# EAGLE design 0121-dcdc1805030 (EAGLE 9.6.2)
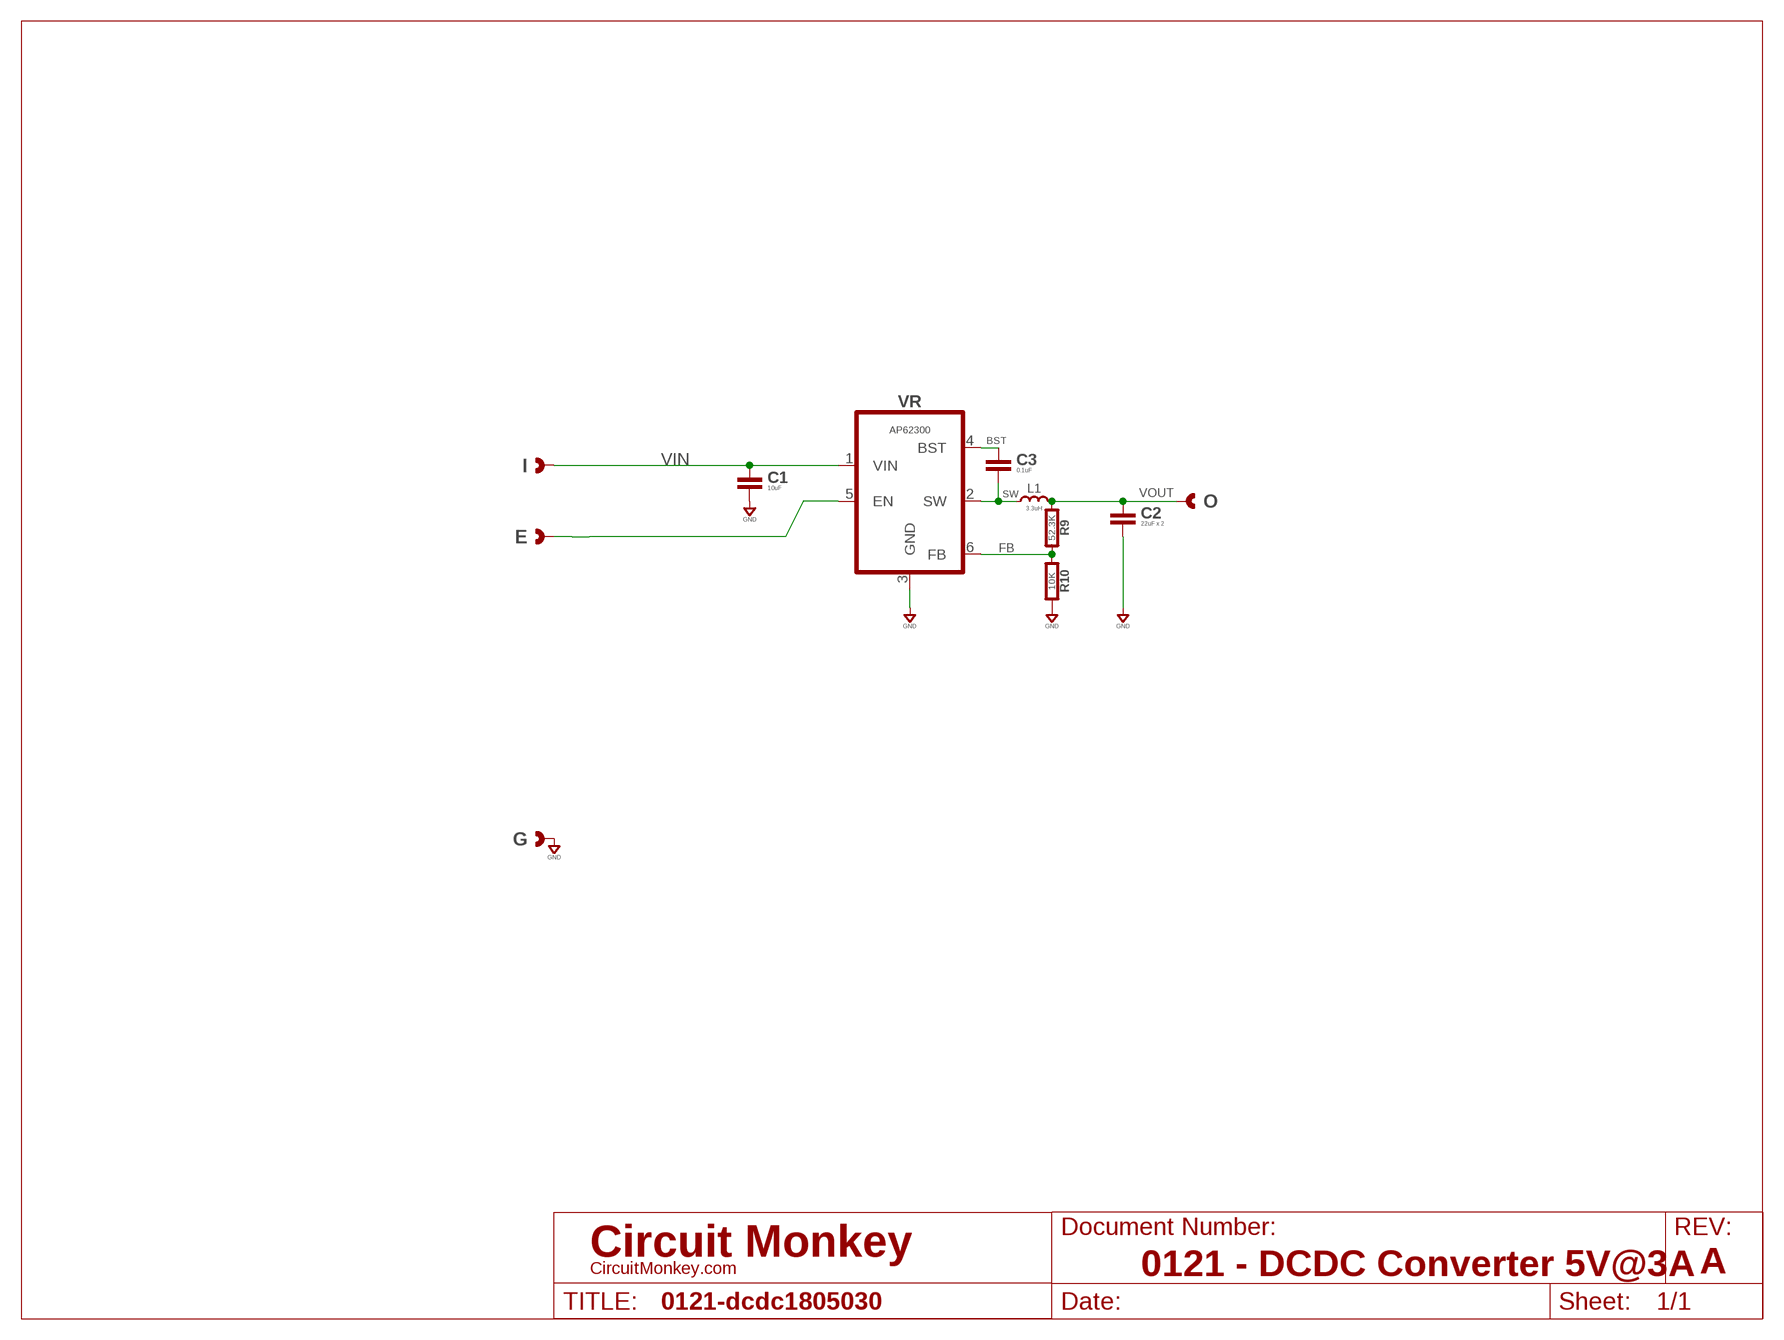
[diagram p0: schematic, sheet 1]
U$1 (LETTER_L-CIRCUITMONKEY): DOCUMENT_NUMBER: 0121 - DCDC Converter 5V@3A; REV: A

## Parts
C1  10uF  CAPACITOR0603  [0603-CAP]
C2  22uF x 2  CAPACITOR0603  [0603-CAP]
C3  0.1uF  CAPACITOR0603  [0603-CAP]
E  CAST-01X12.00MM  [CAST01-2.00MM]
G  CAST-01X12.00MM  [CAST01-2.00MM]
I  CAST-01X12.00MM  [CAST01-2.00MM]
L1  3.3uH  INDUCTORSMD-05X04MM  [IND-SRN5040]
O  CAST-01X12.00MM  [CAST01-2.00MM]
R9  52.3K  RESISTOR0603  [0603-RES]
R10  10K  RESISTOR0603  [0603-RES]
VR  AP62300  BUCKAP62300  [SOT-563-6]

## Nets
BST: C3.1 VR.4(BST)
FB: R9.2 R10.1 VR.6(FB)
GND: C1.2 C2.2 G.1 G.P$1 G.P$2 R10.2 VR.3(GND)
N$1: E.1 E.P$1 E.P$2 VR.5(EN)
SW: C3.2 L1.2 VR.2(SW)
VIN: C1.1 I.1 I.P$1 I.P$2 VR.1(VIN)
VOUT: C2.1 L1.1 O.1 O.P$1 O.P$2 R9.1

## Library data of the parts
C1-C3 = rlc:CAPACITOR: Capacitor
E G I O = con-headers:CAST-01X1: Castelated Edge Hole Pad
L1 = rlc:INDUCTOR: Inductor; MFR: Bourns; MPN: SRN5040-3R3M
R9 R10 = rlc:RESISTOR: Resistor
VR = regulators:BUCK: Buck Regulator; COST01: 0.50; MFR: Diodes, Inc.; MPN: AP62301Z6-7

## Board
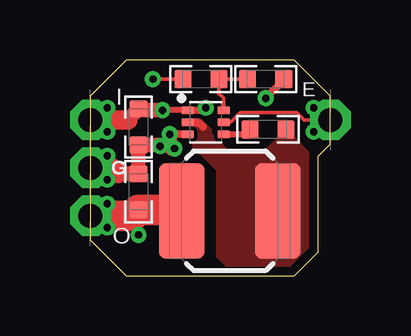
[diagram p1: board, top side]
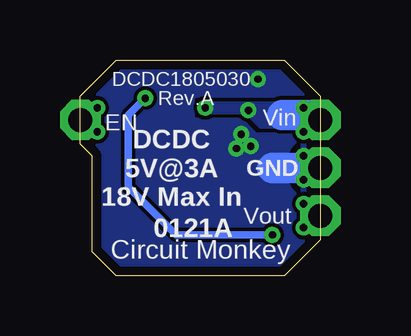
[diagram p2: board, bottom side, seen from below]

Size 10 x 9 mm. Coordinates in mm from the lower left corner, seen from the top.
Outline: 1.5,0 8.5,0 9.5,1 9.5,5 10,5.5 10,7.5 8.5,9 1.5,9 0,7.5 0,1.5 1.5,0
Copper layers (1*16): Top 0.0356mm / dielectric 1.5011mm / Bottom 0.0356mm
Design rules "OSH-CircuitMonkey *": minimum track width 6mil, minimum drill 12mil, track to track 6mil, track to pad 6mil, pad to pad 6mil, via to via 6mil, smd to smd 6mil, copper to edge 15mil, drill to drill 6mil, minimum pad ring 7mil, minimum via ring 7mil, stop-mask expansion 3mil, vias tented up to drill 13mil, thermal gap 10mil

### Footprints (pad centres in the part's own frame; a part is rotated, then mirrored left to right if it is on the bottom)
0603-CAP = smd 0.711 x 0.762: 1 -0.752,0; 2 0.752,0
CAST01-2.00MM = drill 1 pad 1.7 octagon: 1 0,0 | drill 0.305: P$1 -0.7,0.5; P$2 -0.7,-0.5
IND-SRN5040 = smd 1.9 x 4: 1 -2,0; 2 2,0
0603-RES = smd 0.711 x 0.762: 1 -0.752,0; 2 0.752,0
SOT-563-6 = smd 0.32 x 0.5: 1 -0.5,-0.75; 2 0,-0.75; 3 0.5,-0.75; 4 0.5,0.75; 5 0,0.75; 6 -0.5,0.75

### Placement (x,y rotation side)
C1  2,6.2 270 top
C2  2,3.5 90 top
C3  7.4,6.1 0 top
E  10,6.5 0 top
G  0,4.5 180 top
I  0,6.5 180 top
L1  5.8,2.7 0 top
O  0,2.5 180 top
R9  7.3,8.2 180 top
R10  4.6,8.2 180 top
VR  4.8,6.4 270 top

### Tracks (layer width: path | path; a pad name or v marks a point on that pad's centre or on a via)
BST
  Top 0.254: VR.4 6.45,5.9 C3.1
FB
  Top 0.152: VR.6 5.55,7.4 5.35,7.6 R10.1 R9.2
GND  (via drill 0.3)
  Top 0.152: v2.6,8.2 R10.2 | 0.2,4.5 G.P$2 | G.1 0.2,4.5 | 0.2,4.5 G.P$1
  Top 0.305: VR.3 v3.3,5.9
  Top 0.61: 2.85,5.45 C1.2 C2.2 1.15,4.25 | 2.85,5.45 3.15,5.45 3.2,5.5 3.3,5.4 | 2.85,5.45 v2.9,5.4 | v3.3,5.9 3.3,5.4 | v3.5,5.3 3.4,5.3 3.3,5.4
  Top 0.813: G.1 0.9,4.5 1.15,4.25
  Bottom 1.27: G.1 2,4.5
  pour Bottom (rank 5): 8.5,0 1.5,0 0,1.5 0,7.5 1.5,9 8.5,9 10,7.5 10,5.5 9.5,5 9.5,1
N$1
  Top 0.152: VR.5 5.85,6.4 6.25,6.8 8.6,6.8 8.9,6.5 E.1 9.8,6.5 | 9.8,6.5 E.P$1 | 9.8,6.5 E.P$2
SW
  Top 0.305: VR.2 4.4,6.4 4.44,6.37 4.54,6.37 4.7,6.2
  pour Top (rank 3, no thermals): 8.3,0.4 5.7,0.4 5.3,0.8 5.3,4.4 4.3,5.4 4.3,6.5 4.6,6.5 5,6.1 5,5.9 5.7,5.2 7.3,5.2 7.9,5.8 7.9,6.1 8.1,6.3 8.3,6.3 8.4,6.2 8.4,5.8 9.1,5.1 9.1,1.2
VIN  (via drill 0.3)
  Top 0.152: I.P$2 0.5,7 I.1 0.2,6.5 I.P$1
  Top 0.254: VR.1 v3,6.9
  Top 0.3: VR.1 4.55,6.9 4.65,7 v4.8,7
  Top 0.61: v3,6.9 2.05,6.9 C1.1 1.55,6.5
  Top 0.813: I.1 1.55,6.5
  Bottom 1.27: I.1 0.2,6.7 1.6,6.7
  pour Bottom: 0,7.2 5,7.2 5,6.8 3.1,6.8 2.5,6.2 0,6.2
VOUT  (via drill 0.3)
  Top 0.152: 0.2,2.5 O.P$2 | O.1 0.2,2.5 | 0.2,2.5 O.P$1
  Top 0.305: v7.3,7.4 8.05,8.15 R9.1 | C2.1 v2,1.7
  Top 1.27: O.1 1.75,2.5 C2.1 3.75,2.75 L1.1
  Bottom 0.305: v2,1.7 6,1.7 8,3.7 8,6.7 v7.3,7.4

### Text on the board
bPlace: DCDC1805030 | Vin | Rev.A | EN | GND | DCDC / 5V@3A / 18V Max In | Vout | 0121A | Circuit Monkey